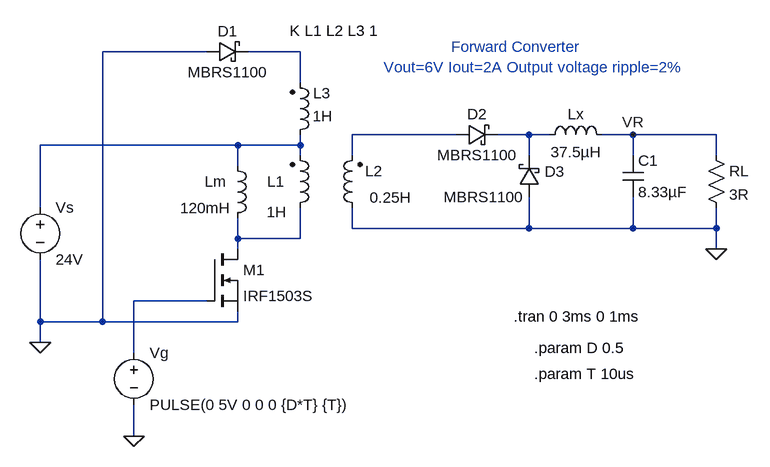
[diagram p0: schematic forward.asc]
forward.asc, the LTspice schematic file:
Version 4
SHEET 1 964 680
WIRE 16 -80 -144 -80
WIRE 160 -80 80 -80
WIRE 160 -32 160 -80
WIRE 400 48 240 48
WIRE 512 48 464 48
WIRE 544 48 512 48
WIRE 672 48 624 48
WIRE 800 48 672 48
WIRE 64 64 -240 64
WIRE 160 64 160 48
WIRE 160 64 64 64
WIRE 160 80 160 64
WIRE 240 80 240 48
WIRE 512 80 512 48
WIRE 672 80 672 48
WIRE 800 80 800 48
WIRE 64 96 64 64
WIRE -240 160 -240 64
WIRE 240 192 240 160
WIRE 512 192 512 144
WIRE 512 192 240 192
WIRE 672 192 672 144
WIRE 672 192 512 192
WIRE 800 192 800 160
WIRE 800 192 672 192
WIRE 64 208 64 176
WIRE 160 208 160 160
WIRE 160 208 64 208
WIRE 64 224 64 208
WIRE 800 224 800 192
WIRE 16 304 -96 304
WIRE -240 336 -240 240
WIRE -144 336 -144 -80
WIRE -144 336 -240 336
WIRE 64 336 64 320
WIRE 64 336 -144 336
WIRE -240 368 -240 336
WIRE -96 384 -96 304
WIRE -96 512 -96 464
FLAG -96 512 0
FLAG 800 224 0
FLAG -240 368 0
FLAG 672 48 VR
SYMBOL ind2 144 176 M180
WINDOW 0 -35 56 Left 2
WINDOW 3 -36 9 Left 2
SYMATTR InstName L1
SYMATTR Value 1H
SYMATTR Type ind
SYMBOL ind2 256 176 R180
WINDOW 0 -31 72 Left 2
WINDOW 3 -75 31 Left 2
SYMATTR InstName L2
SYMATTR Value 0.25H
SYMATTR Type ind
SYMBOL ind2 144 64 M180
WINDOW 0 36 80 Left 2
WINDOW 3 35 45 Left 2
SYMATTR InstName L3
SYMATTR Value 1H
SYMATTR Type ind
SYMBOL voltage -240 144 R0
SYMATTR InstName Vs
SYMATTR Value 24V
SYMBOL nmos 16 224 R0
SYMATTR InstName M1
SYMATTR Value IRF1503S
SYMBOL schottky 16 -64 R270
WINDOW 0 32 32 VTop 2
WINDOW 3 0 32 VBottom 2
SYMATTR InstName D1
SYMATTR Value MBRS1100
SYMATTR Description Diode
SYMATTR Type diode
SYMBOL schottky 400 64 R270
WINDOW 0 32 32 VTop 2
WINDOW 3 0 32 VBottom 2
SYMATTR InstName D2
SYMATTR Value MBRS1100
SYMATTR Description Diode
SYMATTR Type diode
SYMBOL schottky 528 144 R180
WINDOW 0 -39 39 Left 2
WINDOW 3 24 0 Left 2
SYMATTR InstName D3
SYMATTR Value MBRS1100
SYMATTR Description Diode
SYMATTR Type diode
SYMBOL ind 528 64 R270
WINDOW 0 32 56 VTop 2
WINDOW 3 5 56 VBottom 2
SYMATTR InstName Lx
SYMATTR Value 37.5µH
SYMBOL cap 656 80 R0
SYMATTR InstName C1
SYMATTR Value 8.33µF
SYMBOL res 784 64 R0
SYMATTR InstName RL
SYMATTR Value 3R
SYMBOL voltage -96 368 R0
WINDOW 123 0 0 Left 2
WINDOW 39 0 0 Left 2
SYMATTR InstName Vg
SYMATTR Value PULSE(0 5V 0 0 0 {D*T} {T})
SYMBOL ind 48 80 R0
WINDOW 0 -35 40 Left 2
WINDOW 3 -73 81 Left 2
SYMATTR InstName Lm
SYMATTR Value 120mH
TEXT 520 376 Left 2 !.param D 0.5
TEXT 520 416 Left 2 !.param T 10us
TEXT 488 328 Left 2 !.tran 0 3ms 0 1ms
TEXT 144 -112 Left 2 !K L1 L2 L3 1
TEXT 392 -88 Left 2 ;Forward Converter
TEXT 288 -56 Left 2 ;Vout=6V Iout=2A Output voltage ripple=2%

The netlist it stands for:
* forward.asc
L1 N005 N004 1H
L2 0 N002 0.25H
L3 N004 N001 1H
Vs N004 0 24V
M1 N005 N006 0 0 IRF1503S
D1 0 N001 MBRS1100
D2 N002 N003 MBRS1100
D3 0 N003 MBRS1100
Lx N003 VR 37.5µH
C1 VR 0 8.33µF
RL VR 0 3R
Vg N006 0 PULSE(0 5V 0 0 0 {D*T} {T})
Lm N004 N005 120mH
.model D D
.lib standard.dio
.model NMOS NMOS
.model PMOS PMOS
.lib standard.mos
.param D 0.5
.param T 10us
.tran 0 3ms 0 1ms
K L1 L2 L3 1
* Forward Converter
* Vout=6V Iout=2A Output voltage ripple=2%
.backanno
.end